# EAGLE design test (EAGLE 7.5.0)
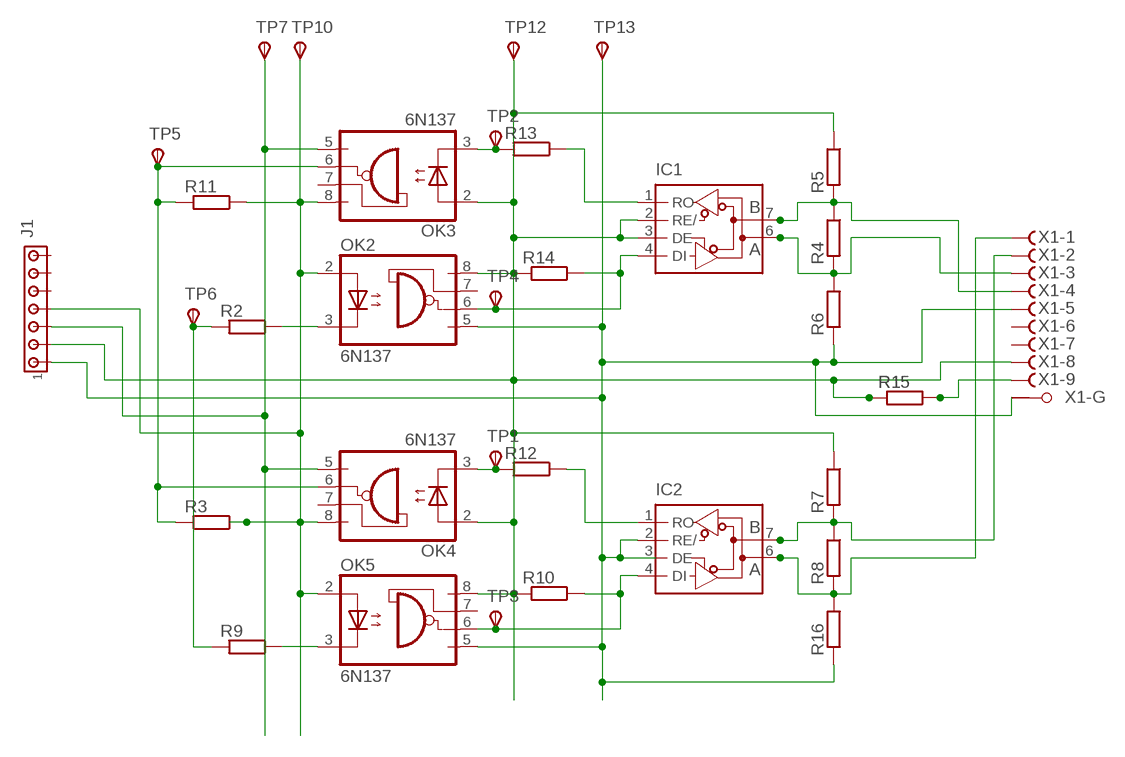
[diagram p0: schematic, sheet 1]

## Parts
IC1  MAX481CSA  [SO08]
IC2  MAX481CSA  [SO08]
J1  MTA07-100  [10X07MTA]
OK2  6N137  [DIL08]
OK3  6N137  [DIL08]
OK4  6N137  [DIL08]
OK5  6N137  [DIL08]
R1  SMK  [SMK]
R2  SMK  [SMK]
R3  SMK  [SMK]
R4  SMK  [SMK]
R5  SMK  [SMK]
R6  SMK  [SMK]
R7  SMK  [SMK]
R8  SMK  [SMK]
R9  SMK  [SMK]
R10  SMK  [SMK]
R11  SMK  [SMK]
R12  SMK  [SMK]
R13  SMK  [SMK]
R14  SMK  [SMK]
R15  SMK  [SMK]
R16  SMK  [SMK]
TP1  TPSB2,54  [B2,54]
TP2  TPSB2,54  [B2,54]
TP3  TPSB2,54  [B2,54]
TP4  TPSB2,54  [B2,54]
TP5  TPSB2,54  [B2,54]
TP6  TPSB2,54  [B2,54]
TP7  TPSB2,54  [B2,54]
TP10  TPSB2,54  [B2,54]
TP12  TPSB2,54  [B2,54]
TP13  TPSB2,54  [B2,54]
X1  F09HPS  [F09HP]

## Nets
5VEXT: IC1.2(RE/) IC1.3(DE) J1.2 OK2.8(VCC) OK3.2(A) OK4.2(A) OK5.8(VCC) R1.2 R5.1 R7.1 R10.2 R14.2 R15.2 TP12.TP(PP) X1.8(-8:F)
N$1: IC1.7(B) R4.1 R5.2 X1.4(-4:F)
N$2: IC1.6(A) R4.2 R6.1 X1.3(-3:F)
N$3: IC2.7(B) R7.2 R8.1 X1.2(-2:F)
N$4: IC2.6(A) R8.2 R16.1 X1.1(-1:F)
N$5: OK3.3(C) R13.2 TP2.TP(PP)
N$6: IC1.1(RO) R13.1
N$7: OK5.3(C) R9.1
N$8: OK4.3(C) R12.2 TP1.TP(PP)
N$9: J1.3 OK3.5(GND) OK4.5(GND) TP7.TP(PP)
N$10: R1.1 R15.1 X1.9(-9:F)
N$11: IC2.4(DI) OK5.6(VO) R10.1 TP3.TP(PP)
N$12: IC1.4(DI) OK2.6(VO) R14.1 TP4.TP(PP)
N$13: OK2.3(C) R2.1
N$14: IC2.2(RE/) J1.1 OK2.5(GND) OK5.5(GND) R6.2 R16.2 TP13.TP(PP) X1.5(-5:F) X1.G1(-G:G1)
N$15: J1.4 OK2.2(A) OK3.8(VCC) OK4.8(VCC) OK5.2(A) R3.1 R11.1 TP10.TP(PP)
N$16: R2.2 R9.2 TP6.TP(PP)
N$17: OK3.6(VO) OK4.6(VO) R3.2 R11.2 TP5.TP(PP)
N$18: IC2.1(RO) R12.1
Unconnected: IC2.3(DE) J1.5 J1.6 J1.7 OK2.7(VE) OK3.7(VE) OK4.7(VE) OK5.7(VE) X1.6(-6:F) X1.7(-7:F) X1.G2(-G:G2)

## Power pins joined to a net without a drawn wire
GND: IC1.5(GND) IC2.5(GND)
VCC: IC1.8(VCC) IC2.8(VCC)

## Library data of the parts
IC1 IC2 = andereBauteile:MAX481: MAX481/485, SN75176BP RS485 Treiber
J1 = con-amp:MTA07-100: AMP connector
OK2-OK5 = optocoupler:6N137: MOTOROLA OPTO COUPLER; MPN: 6N137; OC_FARNELL: 1328376; OC_NEWARK: 52M1895
R1-R16 = resistor-shunt:SMK: SMD SHUNT RESISTOR; OC_FARNELL: unknown; OC_NEWARK: unknown
TP1-TP7 TP10 TP12 TP13 = testpad:TPS: TEST PIN
X1 = con-subd:F09HPS: SUB-D; OC_FARNELL: unknown; OC_NEWARK: unknown

## Board
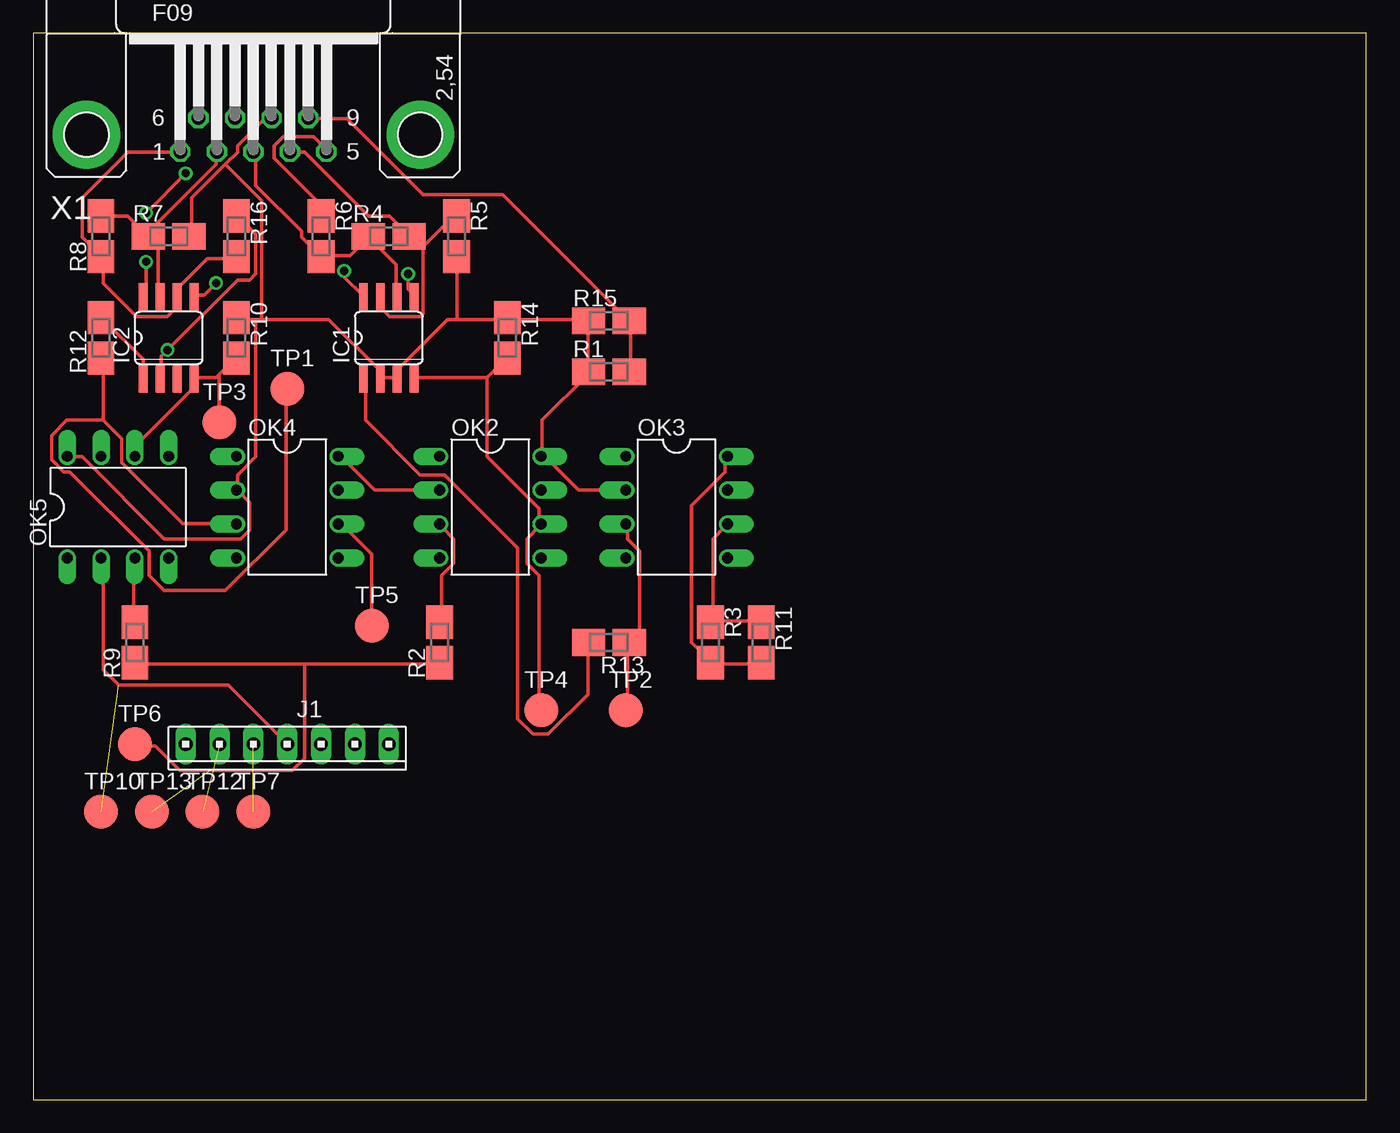
[diagram p1: board, top side]
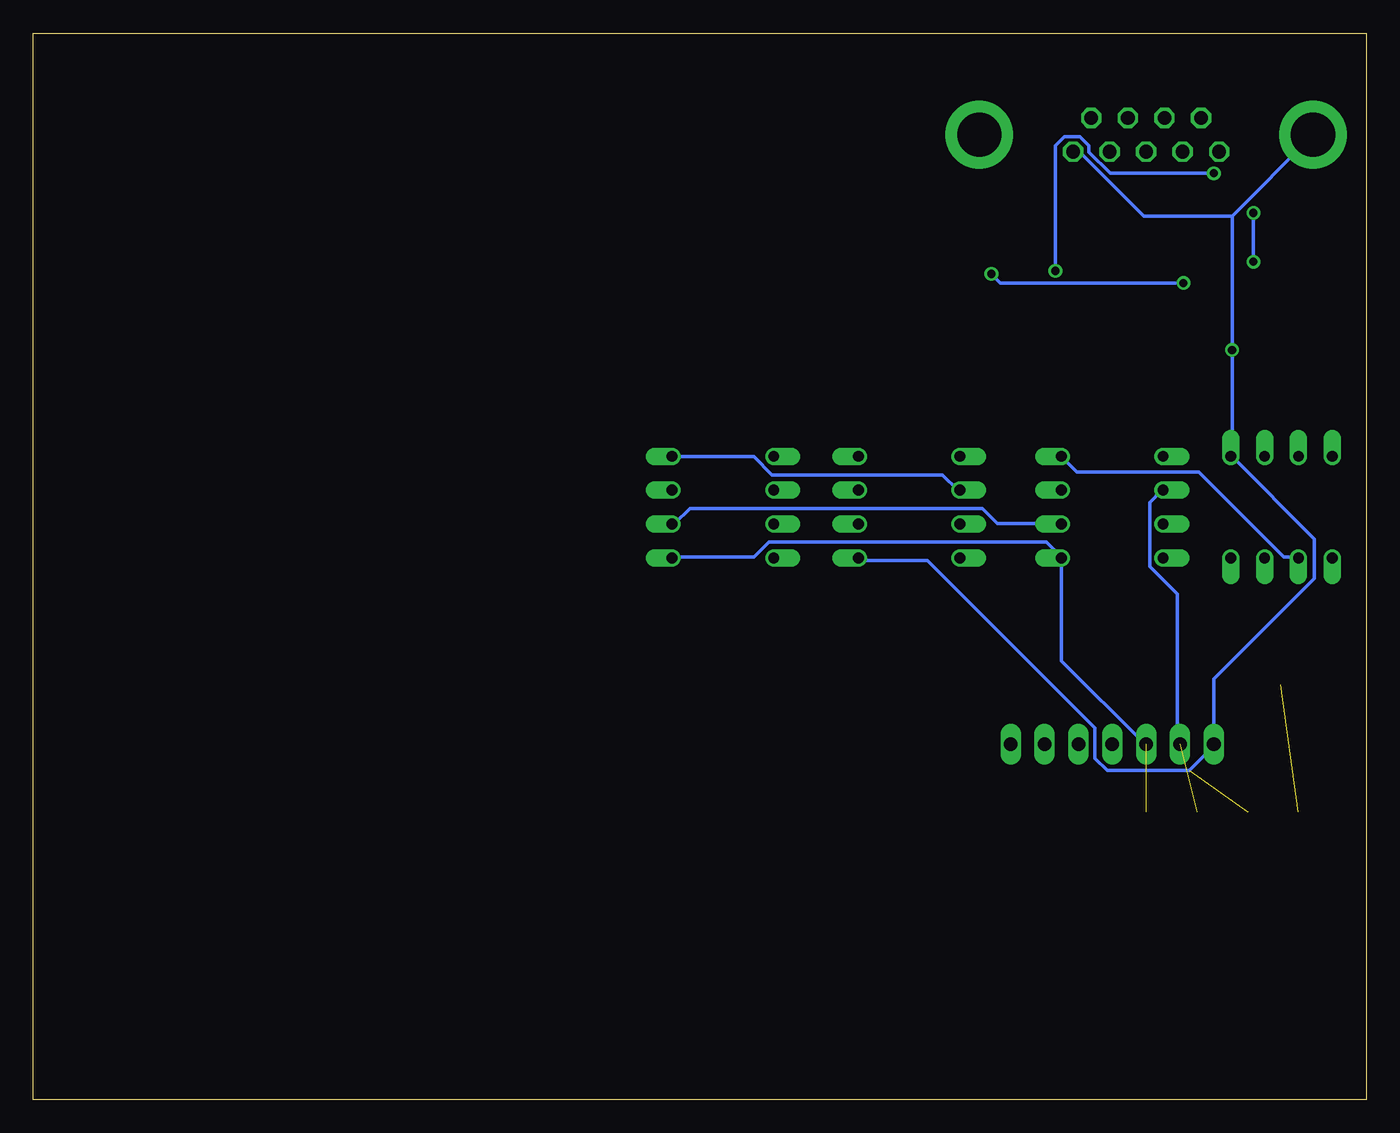
[diagram p2: board, bottom side, seen from below]

Size 100 x 80 mm. Coordinates in mm from the lower left corner, seen from the top.
Outline: 0,0 100,0 100,80 0,80 0,0
Copper layers (1*16): Top 0.035mm / dielectric 1.5mm / Bottom 0.035mm
Design rules "default": minimum track width 10mil, minimum drill 24mil, track to track 8mil, track to pad 8mil, pad to pad 8mil, via to via 8mil, smd to smd 8mil, copper to edge 40mil, drill to drill 8mil, minimum pad ring 10mil, minimum via ring 8mil, stop-mask expansion 4mil, vias tented up to drill 0mil, thermal gap 10mil

### Footprints (pad centres in the part's own frame; a part is rotated, then mirrored left to right if it is on the bottom)
SO08 = smd 0.66 x 2.032: 1 -1.905,-3.073; 2 -0.635,-3.073; 3 0.635,-3.073; 4 1.905,-3.073; 5 1.905,3.073; 6 0.635,3.073; 7 -0.635,3.073; 8 -1.905,3.073
10X07MTA = drill 1.016 long: 1 7.62,0; 2 5.08,0; 3 2.54,0; 4 0,0; 5 -2.54,0; 6 -5.08,0; 7 -7.62,0
DIL08 = drill 0.813 offset: 1 -3.81,-3.81; 2 -1.27,-3.81; 3 1.27,-3.81; 4 3.81,-3.81; 5 3.81,3.81; 6 1.27,3.81; 7 -1.27,3.81; 8 -3.81,3.81
SMK = smd 2.5 x 2: 1 1.524,0; 2 -1.524,0
B2,54 = smd 2.54 x 2.54: TP 0,0
F09HP = drill 1.016 octagon: 1 -5.486,-1.27; 2 -2.743,-1.27; 3 0,-1.27; 4 2.743,-1.27; 5 5.486,-1.27; 6 -4.115,1.27; 7 -1.372,1.27; 8 1.372,1.27; 9 4.115,1.27 | drill 3.302 pad 5.08: G1 -12.522,0; G2 12.522,0

### Placement (x,y rotation side)
IC1  26.67,57.15 0 top
IC2  10.16,57.15 0 top
J1  19.05,26.67 180 top
OK2  34.29,44.45 270 top
OK3  48.26,44.45 270 top
OK4  19.05,44.45 270 top
OK5  6.35,44.45 0 top
R1  43.18,54.61 0 top
R2  30.48,34.29 90 top
R3  50.8,34.29 270 top
R4  26.67,64.77 0 top
R5  31.75,64.77 270 top
R6  21.59,64.77 270 top
R7  10.16,64.77 0 top
R8  5.08,64.77 90 top
R9  7.62,34.29 90 top
R10  15.24,57.15 270 top
R11  54.61,34.29 270 top
R12  5.08,57.15 90 top
R13  43.18,34.29 180 top
R14  35.56,57.15 270 top
R15  43.18,58.42 0 top
R16  15.24,64.77 270 top
TP1  19.05,53.34 0 top
TP2  44.45,29.21 0 top
TP3  13.97,50.8 0 top
TP4  38.1,29.21 0 top
TP5  25.4,35.56 0 top
TP6  7.62,26.67 0 top
TP7  16.51,21.59 0 top
TP10  5.08,21.59 0 top
TP12  12.7,21.59 0 top
TP13  8.89,21.59 0 top
X1  16.51,72.39 0 top

### Tracks (layer width: path | path; a pad name or v marks a point on that pad's centre or on a via)
5VEXT  (1 unrouted)
  Top 0.254: 15.32,45.72 16.23,44.81 16.23,42.75 15.54,42.06 9.83,42.06 3.66,48.23 2.74,48.23 OK5.8 | 14.4,70.18 15.32,71.09 15.32,71.55 17.37,73.61 17.83,73.61 X1.8 | 14.4,70.18 11.89,67.67 11.89,64.92 R7.1 | OK3.2 40.92,45.72 38.18,48.46 | 31.77,58.52 35.43,58.52 R14.2 35.66,58.52 41.6,58.52 R15.2 41.6,58.29 41.6,54.63 R1.2 41.6,54.41 38.18,50.98 38.18,48.46 | 31.77,58.52 31.09,58.52 27.43,54.86 27.43,54.18 IC1.3 27.2,54.18 26.06,54.18 IC1.2 25.83,54.18 25.83,54.86 22.17,58.52 17.14,58.52 | 17.14,58.52 16.69,58.52 | 16.69,58.52 15.32,58.52 R10.2 | 31.77,58.52 31.77,63.09 R5.1 | 38.18,48.46 OK2.8 | 14.4,70.18 17.14,67.44 17.14,58.52 | 15.32,45.72 15.32,46.86 16.69,48.23 16.69,58.52 | 15.32,45.72 OK4.2
  Bottom 0.254: J1.2 14.17,26.75 14.17,37.95 16.23,40.01 16.23,44.81 15.32,45.72 OK4.2
GND  (via drill 0.61)
  Top 0.254: v13.72,61.27 12.8,60.35 12.12,60.35 IC2.5 | v28.12,61.95 28.12,60.81 28.57,60.35 IC1.5
  Bottom 0.254: v13.72,61.27 27.43,61.27 v28.12,61.95
N$1
  Top 0.254: 29.03,64.01 28.35,64.69 R4.1 | 29.03,64.01 29.26,63.78 29.26,58.98 29.03,58.75 26.75,58.75 26.06,59.44 26.06,60.12 IC1.7 | 29.03,64.01 29.26,64.01 31.55,66.29 R5.2 | 29.03,64.01 R4.1 | X1.4 19.43,71.09 20.34,71.09 25.15,66.29 26.75,66.29 28.12,64.92 R4.1
N$2
  Top 0.254: 25.15,64.69 27.2,62.64 27.2,60.35 IC1.6 | 25.15,64.69 23.77,63.32 21.72,63.32 R6.1 21.49,63.32 20.12,64.69 20.12,65.15 16.69,68.58 16.69,71.09 X1.3 | 25.15,64.69 R4.2
N$3
  Top 0.254: IC2.7 9.37,60.35 9.37,64.01 8.69,64.69 R7.2 8.46,64.92 | R8.1 7.09,66.29 8.46,64.92 | 8.46,64.92 13.72,70.18 13.72,71.09 X1.2
N$4
  Top 0.254: R16.1 15.09,63.09 13.03,63.09 10.97,61.04 10.97,60.35 IC2.6 10.74,60.12 10.74,59.44 10.06,58.75 7.77,58.75 5.26,61.27 5.26,63.09 R8.2 5.03,63.32 3.66,64.69 3.66,67.67 7.09,71.09 10.97,71.09 X1.1
N$5
  Top 0.254: TP2.TP 44.58,29.26 44.58,34.29 R13.2 44.81,34.29 45.49,34.98 45.49,41.15 44.58,42.06 44.58,42.98 OK3.3
N$6
  Top 0.254: IC1.1 24.92,53.95 24.92,50.98 29.03,46.86 30.86,46.86 36.35,41.38 36.35,28.57 37.49,27.43 38.63,27.43 41.6,30.4 41.6,34.29 R13.1
N$7
  Top 0.254: R9.1 7.54,35.89 7.54,40.46 OK5.3
N$8
  Top 0.254: 5.26,50.98 5.26,55.55 R12.2 | 5.26,50.98 6.63,49.61 6.63,47.78 11.2,43.2 15.09,43.2 OK4.3 | 5.26,50.98 2.52,50.98 1.37,49.84 1.37,48.01 2.29,47.09 2.74,47.09 8.69,41.15 8.69,39.32 9.83,38.18 14.4,38.18 18.97,42.75 18.97,53.26 TP1.TP
N$9  (1 unrouted)
  Bottom 0.254: J1.3 16.69,26.75 22.86,32.92 OK4.5 22.86,40.69 24,41.83 44.81,41.83 45.95,40.69 51.89,40.69 OK3.5
N$10
  Top 0.254: R1.1 44.81,54.63 44.81,58.29 R15.1 44.58,58.52 35.2,67.89 29.26,67.89 23.55,73.61 20.8,73.61 X1.9
N$11
  Top 0.254: 13.95,54.41 15.09,55.55 R10.1 | 13.95,54.41 13.72,54.18 12.12,54.18 IC2.4 11.89,53.95 11.89,53.26 7.77,49.15 7.77,48.46 OK5.6 | 13.95,54.41 13.95,50.98 TP3.TP
N$12
  Top 0.254: 34.06,54.18 28.57,54.18 IC1.4 | 34.06,54.18 35.43,55.55 R14.1 | 34.06,54.18 34.06,48.23 37.95,44.35 37.95,43.2 OK2.6 37.95,42.98 37.03,42.06 37.03,40.23 37.95,39.32 37.95,29.26 TP4.TP
N$13
  Top 0.254: R2.1 30.63,35.89 30.63,39.32 31.55,40.23 31.55,42.06 30.63,42.98 OK2.3
N$14  (via drill 0.61)  (1 unrouted)
  Top 0.254: IC2.2 9.6,54.18 9.6,55.78 v10.06,56.24 15.32,61.49 16.23,61.49 16.69,61.95 16.69,64.92 15.32,66.29 R16.2 | R6.2 21.49,66.29 21.49,67.21 18.06,70.64 18.06,71.55 18.75,72.24 21.03,72.24 21.95,71.32 X1.5
  Bottom 0.254: OK2.5 37.95,40.46 32.92,40.46 20.34,27.89 20.34,25.6 19.43,24.69 13.26,24.69 11.43,26.52 J1.1 11.43,31.55 3.89,39.09 3.89,42.06 10.06,48.23 OK5.5 10.06,48.46 v10.06,56.24 10.06,66.29 | 10.06,66.29 4.12,72.24 X1.G1 | 10.06,66.29 16.69,66.29 21.49,71.09 21.95,71.09 X1.5
N$15  (1 unrouted)
  Top 0.254: R11.1 54.41,32.69 50.98,32.69 R3.1 50.75,32.92 49.38,34.29 49.38,44.58 51.89,47.09 51.89,48.23 OK3.8 | OK2.2 25.6,45.72 22.86,48.46 OK4.8 | J1.4 14.63,31.09 6.4,31.09 5.26,32.23 5.26,40.46 OK5.2
  Bottom 0.254: OK5.2 5.26,40.69 6.17,40.69 12.57,47.09 21.72,47.09 22.86,48.23 OK4.8 | OK3.8 51.89,48.23 45.95,48.23 44.58,46.86 31.77,46.86 30.63,45.72 OK2.2
N$16
  Top 0.254: 20.34,32.69 30.4,32.69 R2.2 | 20.34,32.69 7.77,32.69 R9.2 | 20.34,32.69 20.34,25.6 19.43,24.69 10.97,24.69 9.14,26.52 7.77,26.52 TP6.TP
N$17
  Top 0.254: 50.98,35.89 54.41,35.89 R11.2 | 50.98,35.89 50.98,42.06 51.89,42.98 OK3.6 | 50.98,35.89 R3.2 | TP5.TP 25.38,35.66 25.38,40.92 23.32,42.98 22.86,42.98 OK4.6
  Bottom 0.254: OK4.6 22.86,43.2 27.66,43.2 28.8,44.35 50.75,44.35 51.89,43.2 OK3.6
N$18
  Top 0.254: IC2.1 8.23,54.18 8.23,55.55 5.26,58.52 R12.1
VCC  (via drill 0.61)
  Top 0.254: v8.46,62.87 8.46,60.35 IC2.8 | v11.43,69.49 v8.46,66.52 | v23.32,62.18 23.32,61.72 24.69,60.35 IC1.8
  Bottom 0.254: v8.46,66.52 v8.46,62.87 | v11.43,69.49 19.2,69.49 20.8,71.09 20.8,71.55 21.49,72.24 22.63,72.24 23.32,71.55 v23.32,62.18